# EAGLE design conrad_r1 (EAGLE 7.6.0)
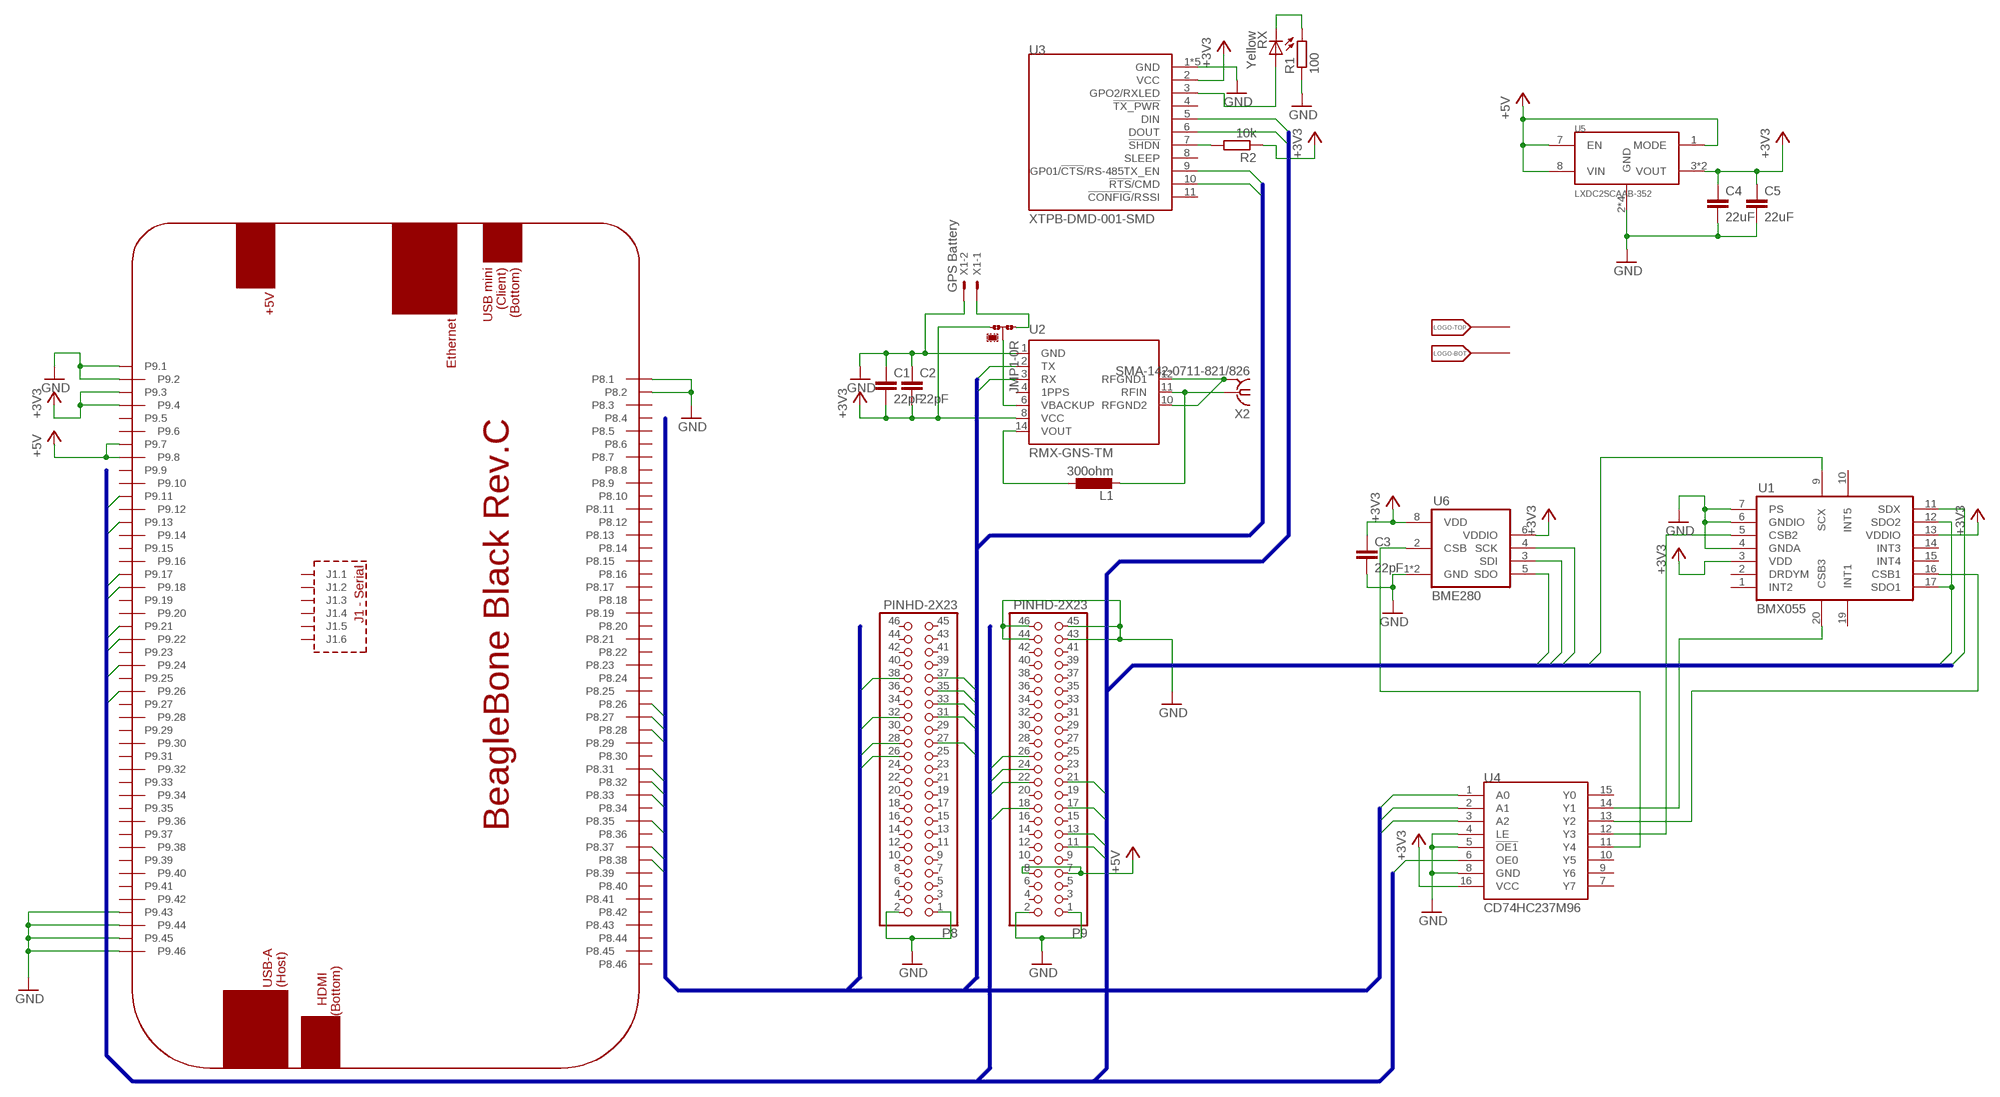
[diagram p0: schematic, sheet 1]

## Parts
C1  22pF  C-EUC0603K  [C0603K]
C2  22pF  C-EUC0603K  [C0603K]
C3  22pF  C-EUC0603K  [C0603K]
C4  22uF  C-EUC0603K  [C0603K]
C5  22uF  C-EUC0603K  [C0603K]
JMP1  0R-JUMPB  [B0R-JMP]
L1  300ohm  L-EUL1206  [L1206]
LOGO  SU_LOGO-DUMMY  [SU_LOGO_DS]
P8  PINHD-2X23  [2X23]
P9  PINHD-2X23  [2X23]
PCB1  BEAGLEBONE_BLACK_EXT  (no package)
R1  100  R-EU_R0402  [R0402]
R2  10k  R-EU_R0402  [R0402]
RX  Yellow  LEDSML0805  [SML0805]
U1  BMX055  [BMX055]
U2  RMX-GNS-TM  [RMX-GNSS-TM]
U3  XTPB-DMD-001-SMD  [XTP9B-DMS-001-SMD]
U4  CD74HC237M96  [SO-16]
U5  LXDC2SCAAB-352  [LXDC2SCAAB-352]
U6  BME280  [BME280]
X1  GPS Battery  C-GRID-02-15-19  [15-91-02]
X2  SMA-142-0711-821/826  [J502-ND-142-0711-821/826]

## Nets
+3V3: C1.2 C2.2 C3.1 C4.1 C5.1 JMP1.3 PCB1.P9.3 PCB1.P9.4 R2.1 U1.3(VDD) U1.13(VDDIO) U2.8(VCC) U3.2(VCC) U4.16(VCC) U5.3(VOUT) U5.4(VOUT) U6.6(VDDIO) U6.8(VDD)
+5V: P9.7 P9.8 PCB1.P9.7 PCB1.P9.8 U5.1(MODE) U5.7(EN) U5.8(VIN)
GND: C1.1 C2.1 C3.2 C4.2 C5.2 P8.1 P8.2 P9.1 P9.2 P9.43 P9.44 P9.45 P9.46 PCB1.P8.1 PCB1.P8.2 PCB1.P9.1 PCB1.P9.2 PCB1.P9.43 PCB1.P9.44 PCB1.P9.45 PCB1.P9.46 R1.1 U1.4(GNDA) U1.6(GNDIO) U1.7(PS) U2.1(GND) U3.1(GND) U3.P$1(GND) U3.P$2(GND) U3.P$3(GND) U3.P$4(GND) U4.4(LE) U4.5(!OE1!) U4.8(GND) U5.2(GND) U5.5(GND) U5.6(GND) U5.9(GND) U6.1(GND) U6.7(GND) X1.2
I2C1_SCL: P9.24 PCB1.P9.24
I2C1_SDA: P9.26 PCB1.P9.26
N$5: L1.2 U2.11(RFIN) X2.1
N$6: JMP1.1 X1.1
N$7: U4.11(Y4) U6.2(CSB)
N$8: U1.5(CSB2) U4.12(Y3)
N$9: L1.1 U2.14(VOUT)
N$10: U1.16(CSB1) U4.13(Y2)
N$11: RX.A U3.3(GPO2/RXLED)
N$12: U1.20(CSB3) U4.14(Y1)
N$14: R1.2 RX.C
N$15: R2.2 U3.7(!SHDN!)
RFGND1: U2.10(RFGND2) U2.12(RFGND1) X2.G@1 X2.G@2 X2.G@3 X2.G@4
SPI0_CS0: P9.17 PCB1.P9.17 U4.6(OE0)
SPI0_D0: P9.21 PCB1.P9.21 U1.12(SDO2) U1.17(SDO1) U6.5(SDO)
SPI0_D1: P9.18 PCB1.P9.18 U1.11(SDX) U6.3(SDI)
SPI0_SCLK: P9.22 PCB1.P9.22 U1.9(SCX) U6.4(SCK)
SPI_CSB26: P8.26 U4.1(A0)
SPI_CSB27: P8.27 PCB1.P8.27 U4.2(A1)
SPI_CSB28: P8.28 PCB1.P8.26 PCB1.P8.28 U4.3(A2)
UART4_CTSN: P8.35 PCB1.P8.35 U3.9(GP01/!CTS!/RS-485TX_EN)
UART4_RTSN: P8.33 PCB1.P8.33 U3.10(!RTS!/CMD)
UART4_RXD: P9.11 PCB1.P9.11 U3.6(DOUT)
UART4_TXD: P9.13 PCB1.P9.13 U3.5(DIN)
UART5_CTSN: P8.31 PCB1.P8.31
UART5_RTSN: P8.32 PCB1.P8.32
UART5_RXD: P8.38 PCB1.P8.38 U2.3(RX)
UART5_TXD: P8.37 PCB1.P8.37 U2.2(TX)
VBACKUP: JMP1.2 U2.6(VBACKUP)
Unconnected: LOGO.P$1 LOGO.P$2 P8.3 P8.4 P8.5 P8.6 P8.7 P8.8 P8.9 P8.10 P8.11 P8.12 P8.13 P8.14 P8.15 P8.16 P8.17 P8.18 P8.19 P8.20 P8.21 P8.22 P8.23 P8.24 P8.25 P8.29 P8.30 P8.34 P8.36 P8.39 P8.40 P8.41 P8.42 P8.43 P8.44 P8.45 P8.46 P9.3 P9.4 P9.5 P9.6 P9.9 P9.10 P9.12 P9.14 P9.15 P9.16 P9.19 P9.20 P9.23 P9.25 P9.27 P9.28 P9.29 P9.30 P9.31 P9.32 P9.33 P9.34 P9.35 P9.36 P9.37 P9.38 P9.39 P9.40 P9.41 P9.42 PCB1.J1.1 PCB1.J1.2 PCB1.J1.3 PCB1.J1.4 PCB1.J1.5 PCB1.J1.6 PCB1.P8.3 PCB1.P8.4 PCB1.P8.5 PCB1.P8.6 PCB1.P8.7 PCB1.P8.8 PCB1.P8.9 PCB1.P8.10 PCB1.P8.11 PCB1.P8.12 PCB1.P8.13 PCB1.P8.14 PCB1.P8.15 PCB1.P8.16 PCB1.P8.17 PCB1.P8.18 PCB1.P8.19 PCB1.P8.20 PCB1.P8.21 PCB1.P8.22 PCB1.P8.23 PCB1.P8.24 PCB1.P8.25 PCB1.P8.29 PCB1.P8.30 PCB1.P8.34 PCB1.P8.36 PCB1.P8.39 PCB1.P8.40 PCB1.P8.41 PCB1.P8.42 PCB1.P8.43 PCB1.P8.44 PCB1.P8.45 PCB1.P8.46 PCB1.P9.5 PCB1.P9.6 PCB1.P9.9 PCB1.P9.10 PCB1.P9.12 PCB1.P9.14 PCB1.P9.15 PCB1.P9.16 PCB1.P9.19 PCB1.P9.20 PCB1.P9.23 PCB1.P9.25 PCB1.P9.27 PCB1.P9.28 PCB1.P9.29 PCB1.P9.30 PCB1.P9.31 PCB1.P9.32 PCB1.P9.33 PCB1.P9.34 PCB1.P9.35 PCB1.P9.36 PCB1.P9.37 PCB1.P9.38 PCB1.P9.39 PCB1.P9.40 PCB1.P9.41 PCB1.P9.42 U1.1(INT2) U1.2(DRDYM) U1.10(INT5) U1.14(INT3) U1.15(INT4) U1.19(INT1) U2.4(1PPS) U3.4(!TX_PWR!) U3.8(SLEEP) U3.11(!CONFIG!/RSSI) U4.7(Y7) U4.9(Y6) U4.10(Y5) U4.15(Y0)

## Buses
P8:UART4_RTSN,UART4_CTSN,UART5_CTSN,UART5_RTSN,UART5_TXD,UART5_RXD,SPI_CSB[26..28]
P9:UART4_RXD,UART4_TXD,SPI0_CS0,SPI0_D1,SPI0_D0,SPI0_SCLK,I2C1_SCL,I2C1_SDA

## Library data of the parts
C1-C5 = resistor:C-EU: CAPACITOR, European symbol
JMP1 = jump-0r-smd:0R-JUMP: SMD 0R 0805 Jumper
L1 = rcl:L-EU: INDUCTOR, European symbol
LOGO = components:SU_LOGO-DUMMY
P8 P9 = pinhead:PINHD-2X23: PIN HEADER
PCB1 = e14_BeagleBoneBlack_RevB:BEAGLEBONE_BLACK_EXT: Device for a BeagleBone Black Rev. C without an associated package. Intended to allow the addition of a BBB in a schematic for the designer to show how wired connections are made to the BBB without having a footprint on the board. More information available at: www.element14.com/community/community/designcenter/single-board-computers/next-gen_beaglebone
R1 R2 = rcl:R-EU_: RESISTOR, European symbol
RX = led:LED: LED OSRAM: - CHIPLED LG R971, LG N971, LY N971, LG Q971, LY Q971, LO R971, LY R971 LH N974, LH R974 LS Q976, LO Q976, LY Q976 LO Q996 - Hyper CHIPLED LW Q18S LB Q993, LB Q99A, LB R99A - SideLED LS A670, LO A670, LY A670, LG A670, LP A670 LB A673, LV A673, LT A673, LW A673 LH A674 LY A675 LS A676, LA A676, LO A676, LY A676, LW A676 LS A679, LY A679, LG A679 - Hyper Micro SIDELED® LS Y876, LA Y876, LO Y876, LY Y876 LT Y87S - SmartLED LW L88C, LW L88S LB L89C, LB L89S, LG L890 LS L89K, LO L89K, LY L89K LS L896, LA L896, LO L896, LY L896 - TOPLED LS T670, LO T670, LY T670, LG T670, LP T670 LSG T670, LSP T670, LSY T670, LOP T670, LYG T670 LG T671, LOG T671, LSG T671 LB T673, LV T673, LT T673, LW T673 LH T674 LS T676, LA T676, LO T676, LY T676, LB T676, LH T676, LSB T676, LW T676 LB T67C, LV T67C, LT T67C, LS T67K, LO T67K, LY T67K, LW E67C LS E67B, LA E67B, LO E67B, LY E67B, LB E67C, LV E67C, LT E67C LW T67C LS T679, LY T679, LG T679 LS T770, LO T770, LY T770, LG T770, LP T770 LB T773, LV T773, LT T773, LW T773 LH T774 LS E675, LA E675, LY E675, LS T675 LS T776, LA T776, LO T776, LY T776, LB T776 LHGB T686 LT T68C, LB T68C - Hyper Mini TOPLED® LB M676 - Mini TOPLED Santana® LG M470 LS M47K, LO M47K, LY M47K Source: http://www.osram.convergy.de LUXEON: - LUMILED® LXK2-PW12-R00, LXK2-PW12-S00, LXK2-PW14-U00, LXK2-PW14-V00 LXK2-PM12-R00, LXK2-PM12-S00, LXK2-PM14-U00 LXK2-PE12-Q00, LXK2-PE12-R00, LXK2-PE12-S00, LXK2-PE14-T00, LXK2-PE14-U00 LXK2-PB12-K00, LXK2-PB12-L00, LXK2-PB12-M00, LXK2-PB14-N00, LXK2-PB14-P00, LXK2-PB14-Q00 LXK2-PR12-L00, LXK2-PR12-M00, LXK2-PR14-Q00, LXK2-PR14-R00 LXK2-PD12-Q00, LXK2-PD12-R00, LXK2-PD12-S00 LXK2-PH12-R00, LXK2-PH12-S00 LXK2-PL12-P00, LXK2-PL12-Q00, LXK2-PL12-R00 Source: www.luxeon.com KINGBRIGHT: KA-3528ASYC Source: www.kingbright.com
U1 = bosch:BMX055: BOSH BMX055 Accelerometer
U2 = linx:RMX-GNS-TM: RMX-GNS-TM GNSS Reciver Module
U3 = XTrend:XTPB-DMD-001-SMD: XTP9B-DMS-001-SMD board footprint with smd connector
U4 = texas:CD74HC237M96: CD74HC237M96 3 bit demultiplexer High output
U5 = murata:LXDC2SCAAB-352: LXDC2SCAAB-352 Micro DC-DC converter 1.2A max 2.8-5.0V input range 3.3V output
U6 = bosch:BME280: DIGITAL HUMIDITY, PRESSURE AND TEMPERATURE SENSOR * Digital interface I²C (up to 3.4 MHz) and SPI (3 and 4 wire, up to 10 MHz)* Supply voltage VDD main supply voltage range: 1.71 V to 3.6 V*VDDIO interface voltage range: 1.2 V to 3.6 V Operating range -40…+85 °C, 0…100 % rel. humidity, 300…1100 hPa The library has been designed by Richard Magdycz <https://www.facebook.com/groups/eaglecadsoftUK>
X1 = con-molex:C-GRID-02: CONNECTOR wire to board 2.54 mm (0.100") pitch header; OC_FARNELL: unknown; OC_NEWARK: unknown
X2 = con-coax:SMA-: SMA 50 Ohm End Launch Jack Receptacle - Round Contact Johnson Components Source: www.johnsoncomponents.com .. J502-ND.pdf; MF: JOHNSON COMPONENTS; MPN: 142-0711-821; OC_FARNELL: 1019328; OC_NEWARK: 16F3627

## Board
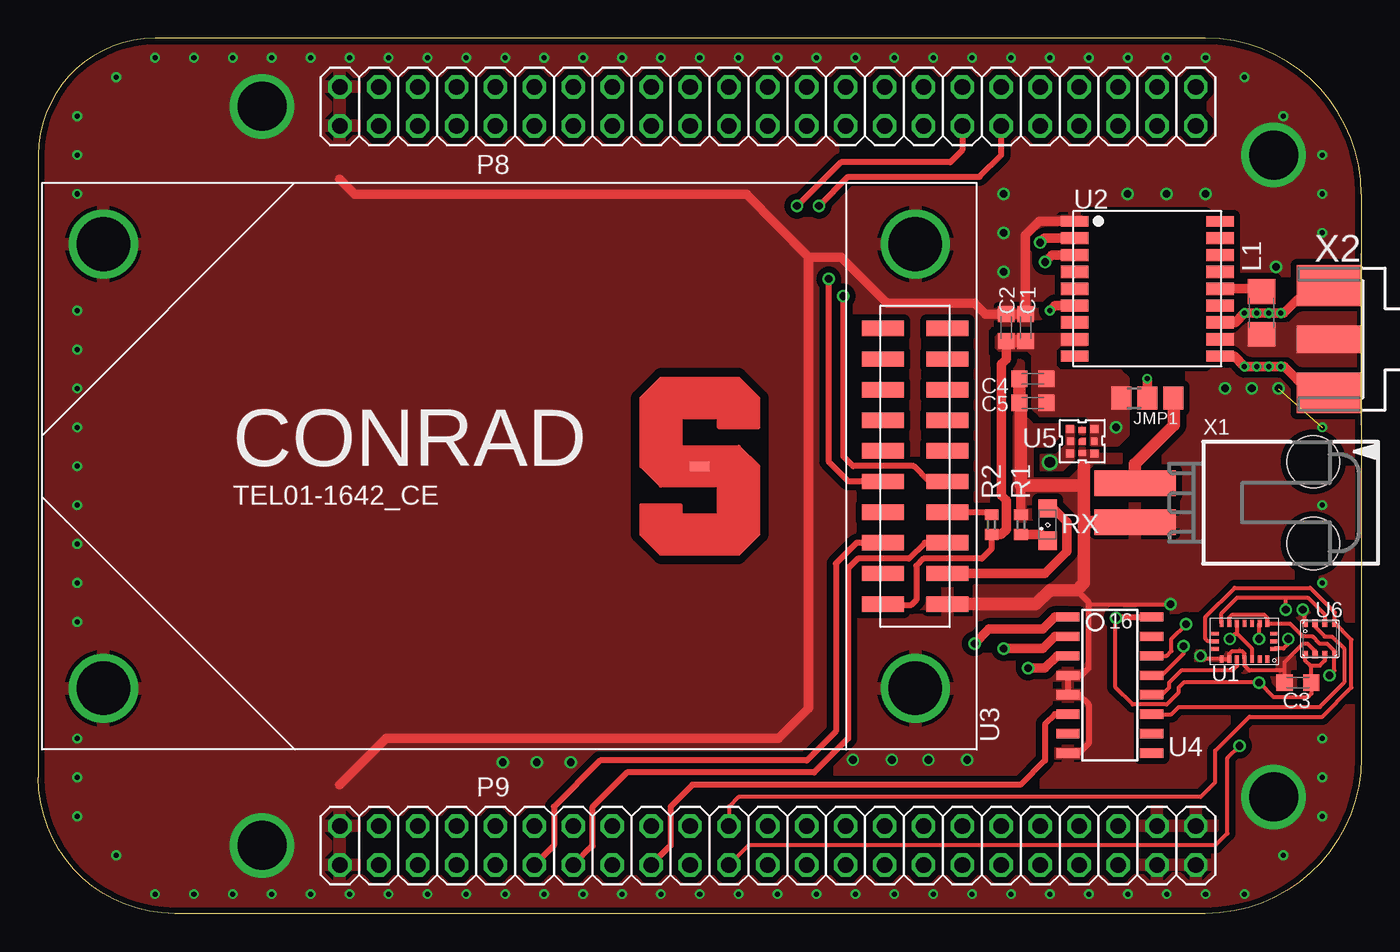
[diagram p1: board, top side]
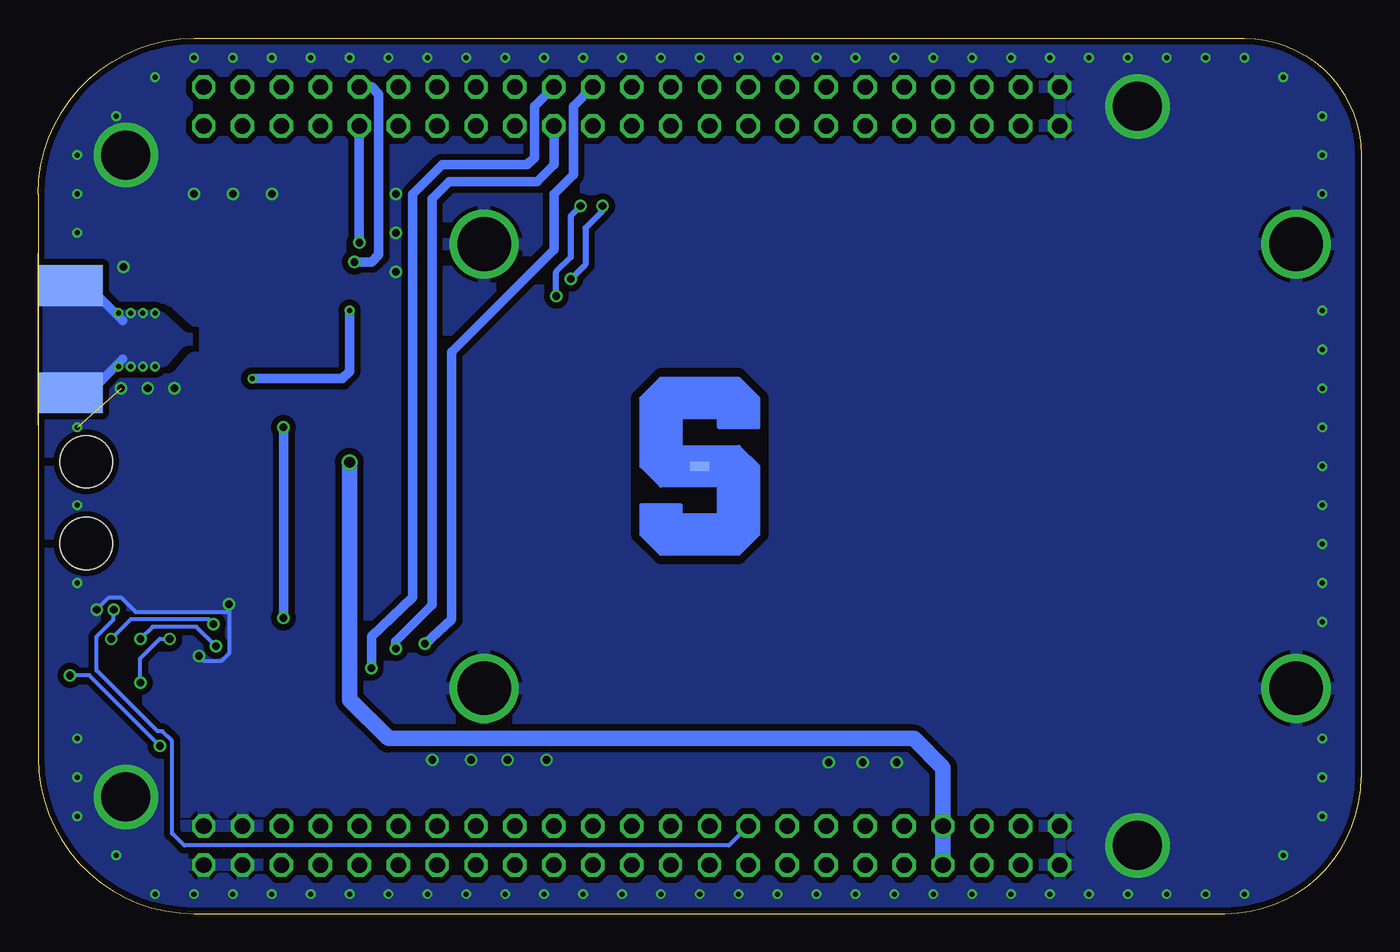
[diagram p2: board, bottom side, seen from below]

Size 86.36 x 57.15 mm. Coordinates in mm from the lower left corner, seen from the top.
Outline: 86.36,46.99 86.36,10.16 arc-90 76.2,0 8.89,0 arc-90 0,8.89 0,49.53 arc-90 7.62,57.15 76.2,57.15 arc-90 86.36,46.99
Copper layers (1*16): Top 0.035mm / dielectric 1.5mm / Bottom 0.035mm
Design rules "DirtyPCBs-2layer": minimum track width 5mil, minimum drill 12mil, track to track 5mil, track to pad 5mil, pad to pad 5mil, via to via 5mil, smd to smd 0mil, copper to edge 10mil, drill to drill 10mil, minimum pad ring 10mil, minimum via ring 6mil, stop-mask expansion 2mil, vias tented up to drill 25mil, thermal gap 10mil
tRestrict: area 68.6,35.8 to 76.2,45.7; area 39.2,23.3 to 47.1,35.1
bRestrict: area 39.2,23.3 to 47.1,35.1

### Footprints (pad centres in the part's own frame; a part is rotated, then mirrored left to right if it is on the bottom)
C0603K = smd 1.05 x 1.08: 1 -0.875,0; 2 0.875,0
B0R-JMP = smd 1.5 x 1.3: 1 0,1.7; 2 0,0; 3 0,-1.7
L1206 = smd 1.6 x 1.8: 1 -1.4,0; 2 1.4,0
SU_LOGO_DS = smd 1.27 x 0.635: P$1 0,0 | smd 1.27 x 0.635 bottom: P$2 0,0
2X23 = drill 1.016 octagon: 1 -27.94,-1.27; 2 -27.94,1.27; 3 -25.4,-1.27; 4 -25.4,1.27; 5 -22.86,-1.27; 6 -22.86,1.27; 7 -20.32,-1.27; 8 -20.32,1.27; 9 -17.78,-1.27; 10 -17.78,1.27; 11 -15.24,-1.27; 12 -15.24,1.27; 13 -12.7,-1.27; 14 -12.7,1.27; 15 -10.16,-1.27; 16 -10.16,1.27; 17 -7.62,-1.27; 18 -7.62,1.27; 19 -5.08,-1.27; 20 -5.08,1.27; 21 -2.54,-1.27; 22 -2.54,1.27; 23 0,-1.27; 24 0,1.27; 25 2.54,-1.27; 26 2.54,1.27; 27 5.08,-1.27; 28 5.08,1.27; 29 7.62,-1.27; 30 7.62,1.27; 31 10.16,-1.27; 32 10.16,1.27; 33 12.7,-1.27; 34 12.7,1.27; 35 15.24,-1.27; 36 15.24,1.27; 37 17.78,-1.27; 38 17.78,1.27; 39 20.32,-1.27; 40 20.32,1.27; 41 22.86,-1.27; 42 22.86,1.27; 43 25.4,-1.27; 44 25.4,1.27; 45 27.94,-1.27; 46 27.94,1.27
R0402 = smd 0.7 x 0.9: 1 -0.65,0; 2 0.65,0
SML0805 = smd 1.2 x 1.2: A 1.05,0; C -1.05,0
BMX055 = smd 0.25 x 0.475: 1 -1.5,1.163; 2 -1,1.163; 3 -0.5,1.163; 4 0,1.163; 5 0.5,1.163; 6 1,1.163; 7 1.5,1.163; 11 1.5,-1.163; 12 1,-1.163; 13 0.5,-1.163; 14 0,-1.163; 15 -0.5,-1.163; 16 -1,-1.163; 17 -1.5,-1.163 | smd 0.475 x 0.25: 8 1.913,0.5; 9 1.913,0; 10 1.913,-0.5; 18 -1.913,-0.5; 19 -1.913,0; 20 -1.913,0.5
RMX-GNSS-TM = smd 1.8 x 0.7: 1 -4.75,4.4; 9 -4.75,-4.4; 10 4.75,-4.4; 18 4.75,4.4 | smd 1.8 x 0.8: 2 -4.75,3.3; 3 -4.75,2.2; 4 -4.75,1.1; 5 -4.75,0; 6 -4.75,-1.1; 7 -4.75,-2.2; 8 -4.75,-3.3; 11 4.75,-3.3; 12 4.75,-2.2; 13 4.75,-1.1; 14 4.75,0; 15 4.75,1.1; 16 4.75,2.2; 17 4.75,3.3
XTP9B-DMS-001-SMD = smd 1 x 2.75: 1 -9,-28.87; 2 -9,-24.67; 3 -7,-28.87; 4 -7,-24.67; 5 -5,-28.87; 6 -5,-24.67; 7 -3,-28.87; 8 -3,-24.67; 9 -1,-28.87; 10 -1,-24.67; 11 1,-28.87; 12 1,-24.67; 13 3,-28.87; 14 3,-24.67; 15 5,-28.87; 16 5,-24.67; 17 7,-28.87; 18 7,-24.67; 19 9,-28.87; 20 9,-24.67 | drill 3.5: P$1 -14.5,-26.77; P$2 14.5,-26.77; P$3 -14.5,26.23; P$4 14.5,26.23
SO-16 = smd 0.61 x 1.524: 1 -4.445,-2.794; 2 -3.175,-2.794; 3 -1.905,-2.794; 4 -0.635,-2.794; 5 0.635,-2.794; 6 1.905,-2.794; 7 3.175,-2.794; 8 4.445,-2.794; 9 4.445,2.667; 10 3.175,2.667; 11 1.905,2.667; 12 0.635,2.667; 13 -0.635,2.667; 14 -1.905,2.667; 15 -3.175,2.667; 16 -4.445,2.667
LXDC2SCAAB-352 = smd 0.5 x 0.5: 1 -0.8,0.8; 3 0.8,0.8; 5 0.8,-0.8; 7 -0.8,-0.8 | smd 0.5 x 0.39: 2 0,0.75; 6 0,-0.75 | smd 0.44 x 0.5: 4 0.78,0; 8 -0.77,0 | smd 0.4 x 0.4: 9 0.03,-0.03
BME280 = smd 0.35 x 0.5: 1 0.975,-1.025; 2 0.325,-1.025; 3 -0.325,-1.025; 4 -0.975,-1.025; 5 -0.975,1.025; 6 -0.325,1.025; 7 0.325,1.025; 8 0.975,1.025
15-91-02 = smd 1.651 x 5.334: 1 -1.27,-10.795; 2 1.27,-10.795 | hole 3.404: -2.667,0.838; 2.667,0.838
J502-ND-142-0711-821/826 = smd 4.191 x 1.778: 1 2.115,0 | smd 4.191 x 2.667: G@1 2.115,3.495; G@2 2.115,-3.495 | smd 4.191 x 2.667 bottom: G@3 2.115,3.495; G@4 2.115,-3.495

### Placement (x,y rotation side)
C1  64.45,38.26 270 top
C2  63.18,38.26 270 top
C3  82.23,15.08 180 top
C4  64.93,34.93 180 top
C5  64.93,33.34 180 top
JMP1  72.39,33.66 270 top
L1  79.85,39.21 270 top
LOGO  43.18,29.21 0 top
P8  47.62,52.71 0 top
P9  47.62,4.45 0 top
R1  64.14,25.4 270 top
R2  62.23,25.4 90 top
RX  65.88,25.4 90 top
U1  78.74,17.78 180 top
U2  72.39,40.8 0 top
U3  30.48,29.21 90 top
U4  70.01,14.92 270 top
U5  68.14,30.84 0 top
U6  83.66,17.94 180 top
X1  82.39,26.83 270 top
X2  86.36,37.5 180 top

### Tracks (layer width: path | path; a pad name or v marks a point on that pad's centre or on a via)
+3V3  (via drill 0.5, 0.51)
  Top 0.254: U6.8 82.69,16.53 83.03,16.19 | U6.6 83.99,16.52 83.66,16.19 83.03,16.19 | 83.03,16.19 83.11,16.12 C3.1 83.11,14.37 82.87,14.13 80.64,14.13 v79.69,15.08 74.77,15.08 74.45,14.76 74.45,14.45 73.66,13.65 71.44,13.65 70.33,14.76 70.33,19.27 v70.36,19.3 | U1.3 79.24,17.28 78.26,18.26 | 78.26,18.26 78.26,18.92 U1.13 | v77.79,17.94 78.11,18.26 78.26,18.26
  Top 0.406: 70.39,19.37 U4.16 | R2.1 62.24,24.75 62.23,24.77 62.23,23.81 61.59,23.18 57.78,23.18 57.31,22.7 57.31,20.48 56.99,20.16 55.2,20.16 U3.2 | C2.2 63.26,37.38 63.18,37.31
  Top 0.61: 70.48,33.86 JMP1.3 | 70.39,19.37 v70.36,19.3 | 63.18,37.31 63.18,36.2 62.87,35.88 62.87,27.3 63.18,26.99 63.18,25.08 62.85,24.75 62.24,24.75
  Top 0.813: C2.2 C1.2
  Bottom 0.254: v79.69,15.08 79.69,16.67 78.42,17.94 v77.79,17.94
  Bottom 0.61: v70.36,31.75 v70.36,19.3 70.34,19.32
  pour Top (isolate 0.127, no thermals): 68.74,30.64 70.48,30.64 71.12,31.27 71.12,34.93 70.64,35.4 66.67,35.4 66.36,35.72 66.36,36.83 66.67,37.15 68.58,37.15 68.58,37.78 62.71,37.78 62.55,37.62 62.55,36.99 62.71,36.83 64.61,36.83 64.93,36.51 64.93,33.02 65.41,32.54 68.42,32.54 68.74,32.23
+5V  (via drill 0.7)
  Bottom 1.016: v66.04,29.46 66.04,13.97 63.5,11.43 29.21,11.43 27.3,9.53 P9.8 P9.7
  pour Top (no thermals): 65.45,29.97 66.47,29.97 67.13,30.62 67.13,31.87 67.6,31.87 67.6,29.64 66.9,28.94 65.45,28.94
GND  (via drill 0.33, 0.5, 3.2)  (1 unrouted)
  Top 0.254: U6.7 83.34,17.15 82.87,17.62 82.55,17.62 81.36,16.43 81.36,15.88 | C3.2 81.36,15.88 | 81.36,15.88 79.06,15.88 78.74,16.19 U1.4 78.74,16.99 78.58,17.14 77.95,17.14 77.74,16.94 U1.6 U1.7 76.09,16.62 v75.88,16.83 | 68.58,20.19 v73.91,20.19 | U6.1 82.69,19.66 v82.55,19.84
  Top 0.406: 67.79,21.11 68.58,20.32 68.58,20.19 68.58,16.03 68.1,15.56 U4.4 U4.5 67.94,14.29 68.58,13.65 68.58,11.11 67.94,10.48 U4.8
  Top 0.61: U2.1 65.36,45.2 64.45,44.29 C1.1 C2.1 61.83,39.13 61.12,39.85 55.4,39.85 52.39,42.86 50.29,42.86 | 19.68,8.41 22.7,11.43 48.32,11.43 50.29,13.4 50.29,42.86 | R1.1 64.14,27.94 | 19.68,47.94 20.64,46.99 46.23,46.99 50.29,42.86
  Top 0.813: 68.26,27.94 64.14,27.94 64.14,33.26 C5.2 C4.2 | 68.26,25.56 X1.2 | 68.26,25.56 68.26,21.59 67.79,21.11 66.04,21.11 65.14,20.21 U3.1 | 68.26,25.56 68.26,27.94 | 68.26,27.94 68.26,29.21
  Bottom 0.254: v75.88,16.83 75.56,16.51 74.39,16.51 73.91,16.99 73.91,19.68 | v82.55,19.84 81.76,20.64 80.96,20.64 80.01,19.68 73.91,19.68 | v73.91,20.19 73.91,19.68
  other vias: 14.61,4.45 80.64,7.62 80.64,49.53 14.61,52.71 63.02,46.99 63.02,44.45 63.02,41.91 60.64,10.03 58.1,10.03 55.72,10.03 53.18,10.03 73.66,46.99 71.12,46.99 76.2,46.99 80.96,34.29 79.22,34.29 77.47,34.29 80.8,42.23 30.32,9.87 32.54,9.87 34.77,9.87 17.78,1.27 15.24,1.27 12.7,1.27 10.16,1.27 7.62,1.27 5.08,3.81 2.54,6.35 2.54,8.89 2.54,11.43 2.54,19.05 2.54,21.59 2.54,24.13 2.54,26.67 2.54,29.21 2.54,31.75 2.54,34.29 2.54,36.83 2.54,39.37 2.54,46.99 2.54,49.53 2.54,52.07 5.08,54.61 7.62,55.88 10.16,55.88 12.7,55.88 17.78,55.88 78.74,54.61 83.82,49.53 81.28,52.07 83.82,46.99 83.82,44.45 83.82,31.75 83.82,26.67 83.82,21.59 83.82,11.43 83.82,8.89 83.82,6.35 81.28,3.81 78.74,1.27 76.2,1.27 73.66,1.27 71.12,1.27 68.58,1.27 66.04,1.27 63.5,1.27 60.96,1.27 58.42,1.27 55.88,1.27 53.34,1.27 50.8,1.27 48.26,1.27 45.72,1.27 43.18,1.27 40.64,1.27 20.32,1.27 22.86,1.27 25.4,1.27 27.94,1.27 30.48,1.27 33.02,1.27 35.56,1.27 38.1,1.27 15.24,55.88 20.32,55.88 22.86,55.88 25.4,55.88 27.94,55.88 30.48,55.88 33.02,55.88 35.56,55.88 38.1,55.88 40.64,55.88 43.18,55.88 45.72,55.88 48.26,55.88 50.8,55.88 53.34,55.88 55.88,55.88 58.42,55.88 60.96,55.88 63.5,55.88 66.04,55.88 68.58,55.88 71.12,55.88 73.66,55.88 76.2,55.88
  pour Top (isolate 0.406, rank 6): 0,49.53 arc-90 7.62,57.15 76.2,57.15 arc-90 86.36,46.99 86.36,10.16 arc-90 76.2,0 8.89,0 arc-90 0,8.89
  pour Bottom (isolate 0.406, rank 6): 0,49.53 arc-90 7.62,57.15 76.2,57.15 arc-90 86.36,46.99 86.36,10.16 arc-90 76.2,0 8.89,0 arc-90 0,8.89
  pour Top (no thermals): 68,31.67 68.3,31.67 68.3,30.27 69.2,30.27 69.2,29.77 68.5,28.97 68,28.97
N$5
  pour Top (no thermals): 76.3,37.87 77.94,37.87 arc45 78.3,38.02 78.58,38.26 78.71,38.38 arc-45 79.16,38.57 81.44,38.57 arc45 81.8,38.72 82.2,39.12 arc-45 82.56,39.27 86.45,39.27 86.45,35.72 82.56,35.72 arc-45 82.2,35.87 81.85,36.22 arc45 81.49,36.37 79.35,36.37 arc-45 78.76,36.61 78.45,36.92 arc45 77.94,37.12 76.3,37.12
N$6
  Top 0.813: X1.1 71.6,29.37 74.14,31.91 74.14,33.5 JMP1.1
N$7
  Top 0.254: U4.11 73.98,13.02 74.45,13.49 83.66,13.49 85.25,15.08 85.25,17.3 84.45,18.1 83.98,18.1 83.34,18.74 U6.2
N$8
  Top 0.254: U4.12 73.34,14.29 73.82,14.76 73.82,15.08 74.61,15.88 77.95,15.88 78.24,16.17 U1.5
N$9
  Top 0.61: U2.14 79.5,40.8 L1.1
N$10  (via drill 0.5 pad 0.25)
  Top 0.254: U4.13 73.34,15.56 74.77,16.99 v74.77,17.46 | v79.69,17.94 79.69,18.89 U1.16
  Bottom 0.254: v74.77,17.46 76.04,18.73 78.9,18.73 v79.69,17.94
N$11
  Top 0.61: RX.A 66.26,26.45 67.15,25.56 67.15,23.65 65.72,22.22 59.37,22.22 U3.3
N$12  (via drill 0.5 pad 0.25)
  Top 0.254: U4.14 73.66,16.83 73.98,17.14 73.98,17.94 v74.93,18.89 | v81.6,17.94 81.6,17.62 81.28,17.3 80.68,17.3 U1.20
  Bottom 0.254: v74.93,18.89 75.25,19.21 80.33,19.21 v81.6,17.94
N$14
  Top 0.61: R1.2 65.48,24.75 RX.C
N$15
  Top 0.406: U3.7 62.07,26.21 R2.2
RFGND1  (via drill 0.33)
  Top 0.61: X2.G@4 83.29,41.12 83.22,41.12 81.31,39.21 v81.12,39.21 v80.33,39.21 v79.53,39.21 v78.74,39.21 78.13,38.6 U2.12 | X2.G@3 83.29,34.13 82.92,34.13 81.33,35.72 v81.12,35.72 v80.33,35.72 v79.53,35.72 v78.74,35.72 78.06,36.4 U2.10
  Bottom 0.61: 80.84,38.74 83.22,41.12 83.29,41.12 X2.G@4 | 80.85,36.2 82.92,34.13 83.29,34.13 X2.G@3
  pour Bottom (isolate 0.254, no thermals): 76.3,37.87 76.51,37.87 arc45 76.87,38.02 78.08,39.12 arc-45 78.43,39.27 78.53,39.37 81.28,39.37 86.45,41.81 86.45,33.18 81.12,35.72 78.27,35.72 78.27,35.72 arc-45 77.92,35.87 77.02,36.92 arc45 76.51,37.12 76.3,37.12
SPI0_CS0
  Top 0.406: U4.6 66.36,13.02 65.72,12.38 65.72,10 64.14,8.41 42.7,8.41 41.27,6.98 41.27,4.45 P9.17
SPI0_D0  (via drill 0.5)
  Top 0.254: U1.12 77.74,19.32 77.95,19.53 80.01,19.53 80.24,19.3 U1.17 81.7,18.94 82.55,18.1 83.19,18.1 83.66,17.62 84.14,17.62 84.64,17.12 U6.5 84.61,16.89 84.61,15.88 v84.3,15.56 | v78.42,10.95 77.63,10.16 77.63,5.24 76.83,4.45 46.35,4.45 P9.21
  Bottom 0.254: v78.42,10.95 83.03,15.56 v84.3,15.56
SPI0_D1  (via drill 0.5)
  Top 0.254: U1.11 77.24,19.61 78.26,20.64 81.44,20.64 | 81.44,20.64 82.87,20.64 83.98,19.53 83.98,19.05 U6.3 | v81.44,19.84 81.44,20.64
  Bottom 0.254: v81.44,19.84 81.44,19.21 82.55,18.1 82.55,15.88 78.58,11.91 78.26,11.91 77.63,11.27 77.63,5.24 76.83,4.45 41.27,4.45 P9.18
SPI0_SCLK
  Top 0.254: U1.9 76.36,17.78 76.2,17.94 76.2,19.37 78.11,21.27 83.03,21.27 84.64,19.66 U6.4 85.72,17.88 85.72,14.76 83.82,12.86 79.06,12.86 76.83,10.64 76.83,8.57 75.88,7.62 45.72,7.62 45.09,6.98 P9.22
SPI_CSB26  (via drill 0.5)
  Top 0.61: U4.1 66.36,19.37 65.56,18.57 62.07,18.57 v61.12,17.62
  Bottom 0.61: v61.12,17.62 59.37,19.21 59.37,36.67 52.7,43.34 52.7,46.99 51.44,48.26 51.44,52.71 P8.26
SPI_CSB27  (via drill 0.5)
  Top 0.61: U4.2 66.36,18.1 65.56,17.3 v63.02,17.3
  Bottom 0.61: v63.02,17.3 63.02,17.78 60.64,20.16 60.64,46.67 59.53,47.78 53.82,47.78 52.7,48.9 P8.27
SPI_CSB28  (via drill 0.5)
  Top 0.61: U4.3 66.52,16.83 65.72,16.03 v64.61,16.03
  Bottom 0.61: v64.61,16.03 64.61,18.1 61.91,20.64 61.91,46.99 60.01,48.9 54.45,48.9 53.98,49.37 53.98,52.71 P8.28
UART4_CTSN  (via drill 0.5)
  Top 0.406: U3.9 58.15,28.21 57.15,29.21 53.18,29.21 52.55,29.84 v52.55,40.32 | v50.96,46.2 52.86,48.1 61.44,48.1 62.87,49.53 P8.35
  Bottom 0.406: v50.96,46.2 51.59,45.56 51.59,42.86 52.55,41.91 v52.55,40.32
UART4_RTSN  (via drill 0.5)
  Top 0.406: 60.33,51.59 P8.33 60.33,49.85 59.53,49.05 52.39,49.05 v49.53,46.2 | v51.59,41.43 51.59,29.53 52.86,28.26 55.1,28.26 U3.10
  Bottom 0.406: v49.53,46.2 49.53,45.88 50.64,44.77 50.64,42.39 v51.59,41.43
UART4_RXD
  Top 0.406: U3.6 53.42,24.21 52.07,22.86 52.07,11.91 50.16,10 36.67,10 33.66,6.98 33.66,4.45 P9.11
UART4_TXD
  Top 0.406: U3.5 57.87,24.21 56.83,23.18 53.5,23.18 52.86,22.54 52.86,11.43 50.64,9.21 38.42,9.21 36.2,6.98 36.2,4.41 36.16,4.41 P9.13
UART5_RXD  (via drill 0.51)
  Top 0.61: U2.3 66.18,43 v65.72,42.55
  Bottom 0.61: P8.38 64.61,53.98 64.14,53.5 64.14,43.02 64.61,42.55 v65.72,42.55
UART5_TXD  (via drill 0.51)
  Top 0.61: U2.2 65.69,44.1 v65.41,43.82
  Bottom 0.61: P8.37 v65.41,43.82
VBACKUP  (via drill 0.33)
  Top 0.61: U2.6 66.37,39.7 v66.04,39.37 | v72.39,34.93 JMP1.2
  Bottom 0.61: v66.04,39.37 66.04,35.4 66.52,34.93 v72.39,34.93

### Text on the board
tPlace: CONRAD | TEL01-1642_CE
Document: S | B